# Altium schematic sheet RF_Block.SchDoc
size A4; CheckedBy: CT-Energys; Author: CT-Energys; CompanyName: HTD COMPANY LIMITED; DrawnBy: CHITOAN; Engineer: CHITOAN; Organization: Altium Limited; Address1: HO CHI MINH CITY; Address2: VIETNAM
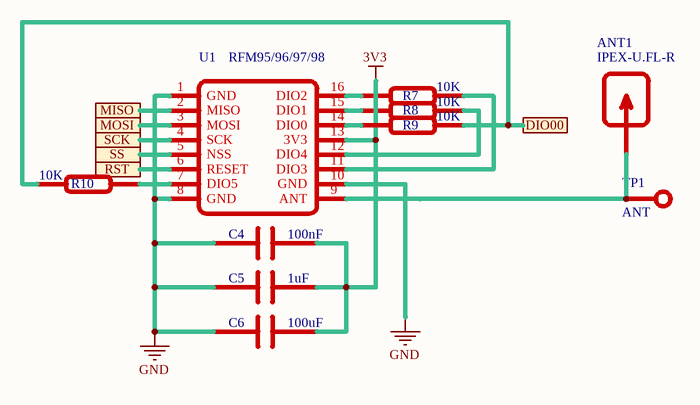
[diagram p0: RF_Block.SchDoc]

## Parts
ANT1  IPEX-U.FL-R  [IPEX Connector SMD]
C4  100nF  [C0805]
C5  1uF  [C0805]
C6  100uF  [C0805]
R7  10K  [R0805]
R8  10K  [R0805]
R9  10K  [R0603]
R10  10K  [R0603]
TP1  ANT  [Test Point]
U1  RFM95/96/97/98  [LORA RFM95/96/97/98W]

## Ports
DIO00, MISO, MOSI, RST, SCK, SS

## Nets
3V3: C4.2 C5.2 C6.2 U1.13(3V3)
GND: C4.1 C5.1 C6.1 U1.1(GND) U1.8(GND) U1.10(GND)
DIO00: R9.2 R10.1 ; port DIO00
MISO: U1.2(MISO) ; port MISO
MOSI: U1.3(MOSI) ; port MOSI
RST: U1.6(RESET) ; port RST
SCK: U1.4(SCK) ; port SCK
SS: U1.5(NSS) ; port SS
NetANT1_1: ANT1.1 TP1.1 U1.9(ANT)
NetR7_1: R7.1 U1.16(DIO2)
NetR7_2: R7.2 U1.11(DIO3)
NetR8_1: R8.1 U1.15(DIO1)
NetR8_2: R8.2 U1.12(DIO4)
NetR9_1: R9.1 U1.14(DIO0)
NetR10_2: R10.2 U1.7(DIO5)

Not connected (* = marked no-connect by the designer): ANT1 2(GND)

## Notes on the sheet
- Title
- Size:
- Date:
- A4
- Number:
- Time:
- Revision:
- Design by:
- Company:
- File:

## Library data of the parts
ANT1 = IPEX-U.FL-R: RF Antena; ComponentLink1Description: Datasheets; ComponentLink1URL: https://cdn.taoglas.com/datasheets/RECE.20279.001E.01.pdf
C4-C6 = CAP-CER: Ceramic Capacitor
R7-R10 = Resistor
TP1 = TestPoint: Test Point
U1 = RFM95/96/97/98 LORA Module: The RFM95/96/97/98(W) transceivers feature the LoRaTM    long range modem that provides ultra-long range spread spectrum communication and high interference immunity whilst minimising current consumption.; ComponentLink1Description: RFM95/96/97/98; ComponentLink1URL: https://cdn.sparkfun.com/assets/learn_tutorials/8/0/4/RFM95_96_97_98W.pdf